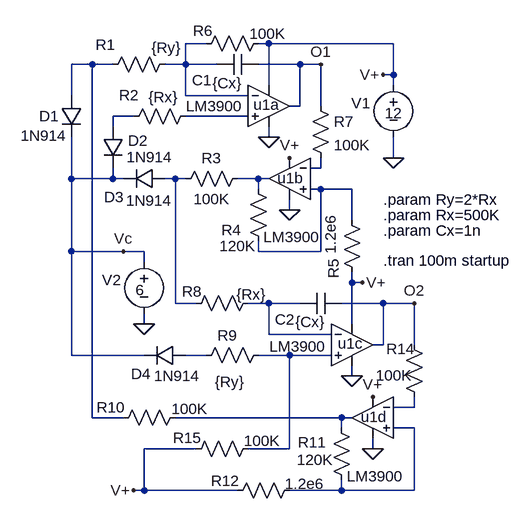
[diagram p0: schematic VcoQuadNorton.asc]
VcoQuadNorton.asc, the LTspice schematic file:
Version 4
SHEET 1 880 912
WIRE -496 224 -496 176
WIRE -496 352 -496 288
WIRE -496 464 -496 352
WIRE -496 624 -496 464
WIRE -464 176 -496 176
WIRE -464 720 -464 176
WIRE -432 176 -464 176
WIRE -432 272 -432 256
WIRE -432 352 -496 352
WIRE -432 352 -432 336
WIRE -416 352 -432 352
WIRE -416 464 -496 464
WIRE -416 720 -464 720
WIRE -400 256 -432 256
WIRE -384 464 -416 464
WIRE -384 480 -384 464
WIRE -384 576 -384 560
WIRE -384 624 -496 624
WIRE -384 832 -400 832
WIRE -384 832 -384 768
WIRE -336 352 -352 352
WIRE -336 544 -336 352
WIRE -320 176 -352 176
WIRE -320 176 -320 144
WIRE -320 224 -320 176
WIRE -320 352 -336 352
WIRE -304 544 -336 544
WIRE -304 768 -384 768
WIRE -288 144 -320 144
WIRE -288 624 -320 624
WIRE -272 176 -320 176
WIRE -240 832 -384 832
WIRE -224 224 -320 224
WIRE -224 256 -320 256
WIRE -208 352 -240 352
WIRE -208 368 -208 352
WIRE -208 464 -208 448
WIRE -192 144 -208 144
WIRE -192 208 -192 144
WIRE -192 288 -192 272
WIRE -192 352 -208 352
WIRE -192 544 -224 544
WIRE -192 592 -192 544
WIRE -160 400 -160 384
WIRE -160 624 -208 624
WIRE -160 768 -224 768
WIRE -160 768 -160 624
WIRE -144 176 -208 176
WIRE -144 240 -160 240
WIRE -144 240 -144 176
WIRE -144 544 -192 544
WIRE -112 176 -144 176
WIRE -112 240 -112 176
WIRE -112 336 -128 336
WIRE -112 336 -112 320
WIRE -112 368 -128 368
WIRE -112 464 -208 464
WIRE -112 464 -112 368
WIRE -96 592 -192 592
WIRE -96 624 -160 624
WIRE -80 720 -336 720
WIRE -80 736 -80 720
WIRE -80 832 -160 832
WIRE -80 832 -80 816
WIRE -64 368 -112 368
WIRE -64 416 -64 368
WIRE -64 512 -64 496
WIRE -64 576 -64 512
WIRE -64 656 -64 640
WIRE -64 720 -80 720
WIRE -48 512 -64 512
WIRE -32 768 -32 752
WIRE -16 544 -80 544
WIRE -16 608 -32 608
WIRE -16 608 -16 544
WIRE 0 144 -192 144
WIRE 0 192 -16 192
WIRE 0 192 0 144
WIRE 0 208 0 192
WIRE 0 320 0 288
WIRE 32 544 -16 544
WIRE 32 608 32 544
WIRE 32 704 0 704
WIRE 32 704 32 688
WIRE 32 736 0 736
WIRE 32 832 -80 832
WIRE 32 832 32 736
FLAG -160 320 V+
FLAG -160 400 0
FLAG -192 288 0
FLAG 0 320 0
FLAG -16 192 V+
FLAG -32 688 V+
FLAG -32 768 0
FLAG -64 656 0
FLAG -400 832 V+
FLAG -48 512 V+
FLAG -416 464 Vc
FLAG -112 176 O1
FLAG 32 544 O2
FLAG -384 576 0
SYMBOL voltage 0 192 R0
WINDOW 0 -65 44 Left 0
WINDOW 3 -13 59 Left 0
WINDOW 123 0 0 Left 0
SYMATTR InstName V1
SYMATTR Value 12
SYMATTR SpiceLine Rser=1 Cpar=100n
SYMBOL LM3900 -192 176 R0
WINDOW 3 -8 266 Left 0
WINDOW 0 -24 62 Left 0
WINDOW 38 -80 101 Center 0
SYMATTR InstName u1a
SYMBOL LM3900 -160 288 M0
WINDOW 3 72 -48 Left 0
WINDOW 0 -22 63 Left 0
WINDOW 38 -2 149 Center 0
SYMATTR InstName u1b
SYMBOL cap -272 192 R270
WINDOW 0 -24 -23 VTop 0
WINDOW 3 3 16 VBottom 0
SYMATTR InstName C1
SYMATTR Value {Cx}
SYMBOL res -336 160 R90
WINDOW 0 1 107 VBottom 0
WINDOW 3 -25 14 VTop 0
SYMATTR InstName R1
SYMATTR Value {Ry}
SYMBOL res -304 240 R90
WINDOW 0 -1 103 VBottom 0
WINDOW 3 -29 50 VTop 0
SYMATTR InstName R2
SYMATTR Value {Rx}
SYMBOL diode -512 224 R0
WINDOW 0 -34 32 Left 0
WINDOW 3 -62 62 Left 0
SYMATTR InstName D1
SYMATTR Value 1N914
SYMBOL diode -448 272 R0
WINDOW 0 39 21 Left 0
WINDOW 3 37 47 Left 0
SYMATTR InstName D2
SYMATTR Value 1N914
SYMBOL res -224 336 R90
WINDOW 0 0 56 VBottom 0
WINDOW 3 32 56 VTop 0
SYMATTR InstName R3
SYMATTR Value 100K
SYMATTR SpiceLine tol=1 pwr=0.1
SYMBOL res -224 352 R0
WINDOW 0 -41 79 Left 0
WINDOW 3 -44 104 Left 0
SYMATTR InstName R4
SYMATTR Value 120K
SYMATTR SpiceLine tol=1 pwr=0.1
SYMBOL diode -352 336 R90
WINDOW 0 60 78 VBottom 0
WINDOW 3 34 24 VTop 0
SYMATTR InstName D3
SYMATTR Value 1N914
SYMBOL res -48 512 R180
WINDOW 0 60 21 VBottom 0
WINDOW 3 33 74 VTop 0
SYMATTR InstName R5
SYMATTR Value 1.2e6
SYMATTR SpiceLine tol=1 pwr=0.1
SYMBOL res -192 128 R90
WINDOW 0 12 101 VBottom 0
WINDOW 3 -15 2 VTop 0
SYMATTR InstName R6
SYMATTR Value 100K
SYMATTR SpiceLine tol=1 pwr=0.1
SYMBOL res -128 224 R0
SYMATTR InstName R7
SYMATTR Value 100K
SYMATTR SpiceLine tol=1 pwr=0.1
SYMBOL LM3900 -64 544 R0
WINDOW 3 -8 266 Left 0
WINDOW 0 -22 62 Left 0
WINDOW 38 -92 65 Center 0
SYMATTR InstName u1c
SYMBOL LM3900 -32 656 M0
WINDOW 3 71 -46 Left 0
WINDOW 0 -22 63 Left 0
WINDOW 38 67 40 Center 0
SYMATTR InstName u1d
SYMBOL cap -144 560 R270
WINDOW 0 -24 -23 VTop 0
WINDOW 3 3 16 VBottom 0
SYMATTR InstName C2
SYMATTR Value {Cx}
SYMBOL res -320 704 R90
WINDOW 0 16 115 VBottom 0
WINDOW 3 -13 -6 VTop 0
SYMATTR InstName R10
SYMATTR Value 100K
SYMATTR SpiceLine tol=1 pwr=0.1
SYMBOL res -96 720 R0
WINDOW 0 -51 38 Left 0
WINDOW 3 -53 65 Left 0
SYMATTR InstName R11
SYMATTR Value 120K
SYMATTR SpiceLine tol=1 pwr=0.1
SYMBOL res -144 816 R90
WINDOW 0 17 115 VBottom 0
WINDOW 3 -10 -7 VTop 0
SYMATTR InstName R12
SYMATTR Value 1.2e6
SYMATTR SpiceLine tol=1 pwr=0.1
SYMBOL res 16 592 R0
WINDOW 0 -27 22 Left 0
WINDOW 3 -43 63 Left 0
SYMATTR InstName R14
SYMATTR Value 100K
SYMATTR SpiceLine tol=1 pwr=0.1
SYMBOL diode -320 608 R90
WINDOW 0 60 69 VBottom 0
WINDOW 3 32 13 VTop 0
SYMATTR InstName D4
SYMATTR Value 1N914
SYMBOL res -208 752 R90
WINDOW 0 15 109 VBottom 0
WINDOW 3 -12 -6 VTop 0
SYMATTR InstName R15
SYMATTR Value 100K
SYMATTR SpiceLine tol=1 pwr=0.1
SYMBOL res -192 608 R90
WINDOW 0 1 64 VBottom 0
WINDOW 3 41 60 VTop 0
SYMATTR InstName R9
SYMATTR Value {Ry}
SYMBOL res -208 528 R90
WINDOW 0 13 102 VBottom 0
WINDOW 3 -13 11 VTop 0
SYMATTR InstName R8
SYMATTR Value {Rx}
SYMBOL voltage -384 464 R0
WINDOW 0 -65 44 Left 0
WINDOW 3 -13 59 Left 0
WINDOW 123 0 0 Left 0
WINDOW 39 0 0 Left 0
SYMATTR InstName V2
SYMATTR Value 6
TEXT -16 384 Left 0 !.param Ry=2*Rx
TEXT -16 408 Left 0 !.param Rx=500K
TEXT -16 432 Left 0 !.param Cx=1n
TEXT -16 478 Left 0 !.tran 100m startup

The netlist it stands for:
* VcoQuadNorton.asc
V1 V+ 0 12 Rser=1 Cpar=100n
* u1a: LM3900 (symbol LM3900 not available, pins judged from their places): In+=N006 In-=N004 V+=V+ V-=0 OUT=O1
* u1b: LM3900 (symbol LM3900 not available, pins judged from their places): In+=N008 In-=N011 V+=V+ V-=0 OUT=N007
C1 N004 O1 {Cx}
R1 N004 N001 {Ry}
R2 N006 N002 {Rx}
D1 N001 Vc 1N914
D2 N002 Vc 1N914
R3 N007 N003 100K tol=1 pwr=0.1
R4 N007 N008 120K tol=1 pwr=0.1
D3 N003 Vc 1N914
R5 V+ N008 1.2e6 tol=1 pwr=0.1
R6 V+ N004 100K tol=1 pwr=0.1
R7 O1 N011 100K tol=1 pwr=0.1
* u1c: LM3900 (symbol LM3900 not available, pins judged from their places): In+=N010 In-=N009 V+=V+ V-=0 OUT=O2
* u1d: LM3900 (symbol LM3900 not available, pins judged from their places): In+=N013 In-=N014 V+=V+ V-=0 OUT=N012
C2 N009 O2 {Cx}
R10 N012 N001 100K tol=1 pwr=0.1
R11 N012 N013 120K tol=1 pwr=0.1
R12 N013 V+ 1.2e6 tol=1 pwr=0.1
R14 O2 N014 100K tol=1 pwr=0.1
D4 N005 Vc 1N914
R15 N010 V+ 100K tol=1 pwr=0.1
R9 N010 N005 {Ry}
R8 N009 N003 {Rx}
V2 Vc 0 6
.model D D
.lib standard.dio
.param Ry=2*Rx
.param Rx=500K
.param Cx=1n
.tran 100m startup
.backanno
.end